# Altium schematic sheet MCU.SchDoc: MCU
size 297 x 209 mm; Author: Dmitry Shpakov; Organization: NoName; Revision: Revision; SheetNumber: 6; SheetTotal: 10; PageSize: A4; ProjectName: Project Name
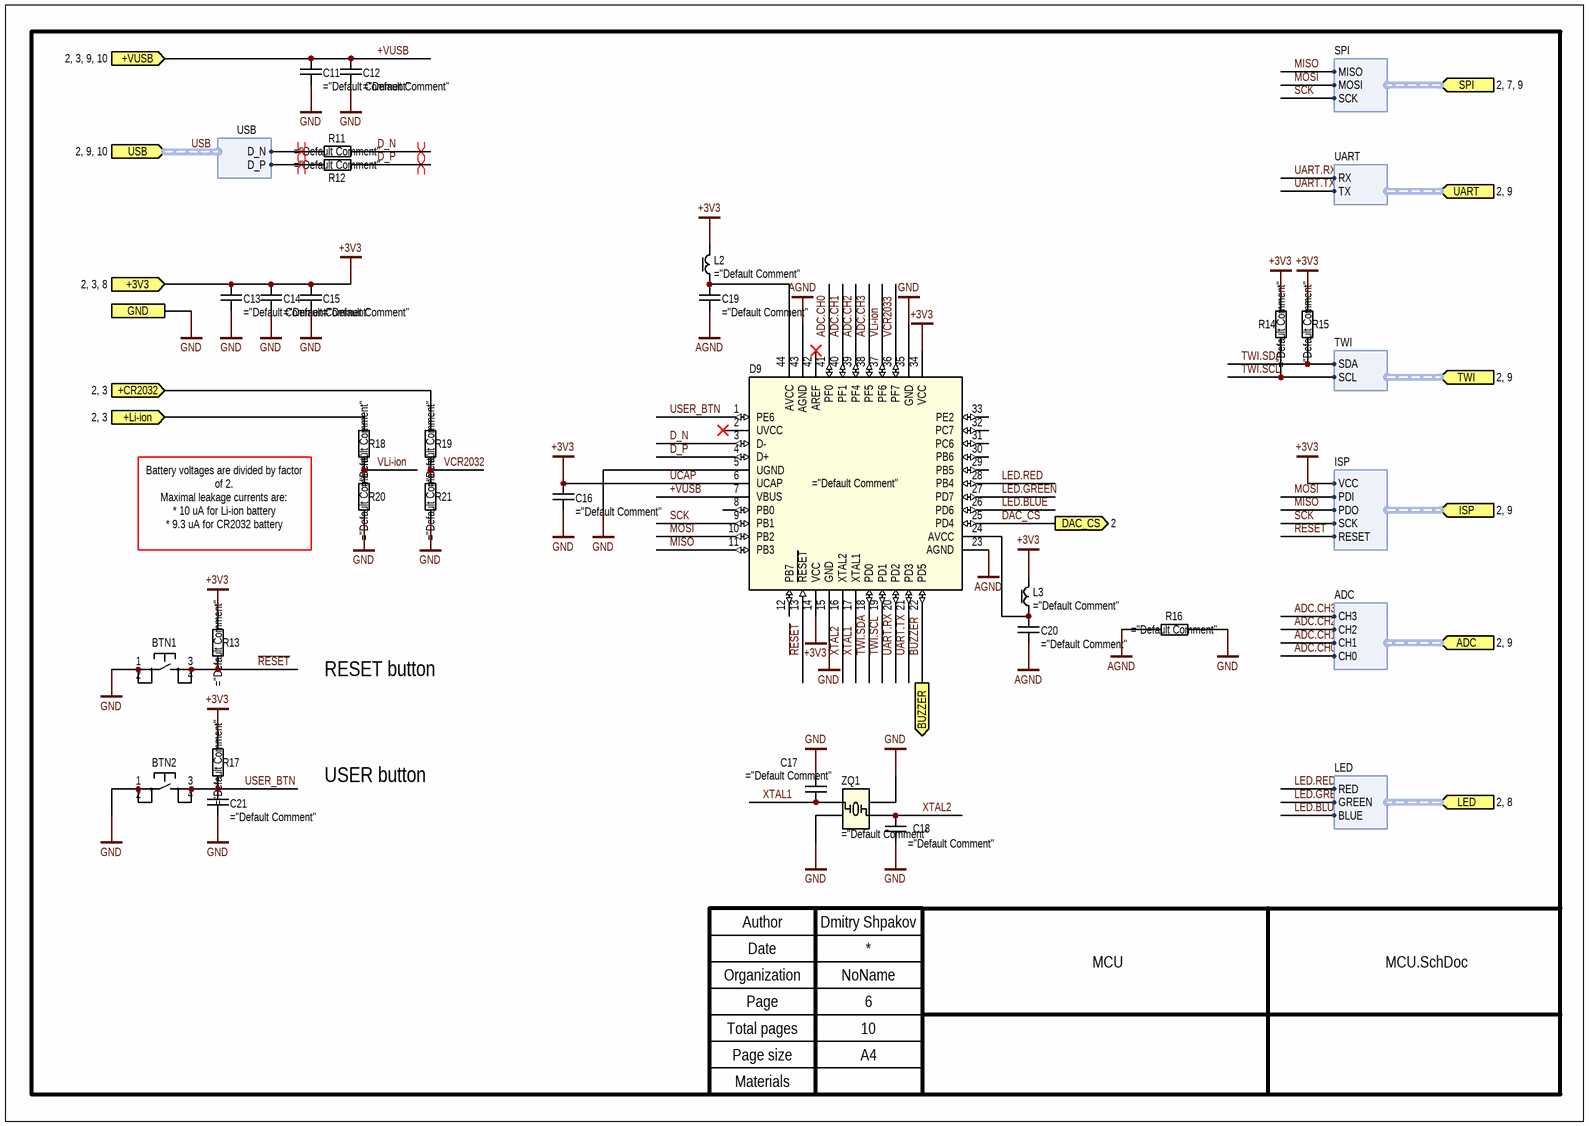
[diagram p0: MCU.SchDoc]

## Parts
BTN1  (no value)
BTN2  (no value)
C11  (no value)
C12  (no value)
C13  (no value)
C14  (no value)
C15  (no value)
C16  (no value)
C17  (no value)
C18  (no value)
C19  (no value)
C20  (no value)
C21  (no value)
D9  (no value)
L2  (no value)
L3  (no value)
R11  (no value)
R12  (no value)
R13  (no value)
R14  (no value)
R15  (no value)
R16  (no value)
R17  (no value)
R18  (no value)
R19  (no value)
R20  (no value)
R21  (no value)
ZQ1  (no value)

## Ports
+3V3 (in, see 2, 3, 8), +CR2032 (in, see 2, 3), +Li-ion (in, see 2, 3), +VUSB (in, see 2, 3, 9, 10), ADC (in, harness ADC, see 2, 9), BUZZER (out), DAC_CS (out, see 2), GND (see 2, 3, 4, 5, 7, 8, 9, 10), ISP (in, harness ISP, see 2, 9), LED (in, harness LED, see 2, 8), SPI (in, harness SPI, see 2, 7, 9), TWI (in, harness TWI, see 2, 9), UART (in, harness UART, see 2, 9), USB (in, harness USB, see 2, 9, 10)

## Harnesses
USB: D_N, D_P
SPI: MISO, MOSI, SCK
UART: RX, TX
TWI: SDA, SCL
ISP: VCC, PDI, PDO, SCK, RESET
ADC: CH3, CH2, CH1, CH0
LED: RED, GREEN, BLUE

## Nets
AGND: C19.1 C20.1 D9.23(AGND) D9.43(AGND) R16.1
GND: BTN1.1 BTN1.2 BTN2.1 BTN2.2 C11.1 C12.1 C13.1 C14.1 C15.1 C16.1 C17.1 C18.1 C21.1 D9.5(UGND) D9.15(GND) D9.35(GND) R16.2 R20.1 R21.1 ZQ1.2 ZQ1.4 ; port GND
UCAP: C13.2 C14.2 C15.2 C16.2 D9.6(UCAP) D9.14(VCC) D9.34(VCC) L2.2 L3.2 R13.2 R14.2 R15.2 R17.2 ; port +3V3, port ISP.VCC  [also labelled +3V3]
+CR2032: R19.2 ; port +CR2032
+Li-ion: R18.2 ; port +Li-ion
+VUSB: C11.2 C12.2 D9.7(VBUS) ; port +VUSB
ADC.CH0: D9.41(PF0) ; port ADC.CH0
ADC.CH1: D9.40(PF1) ; port ADC.CH1
ADC.CH2: D9.39(PF4) ; port ADC.CH2
ADC.CH3: D9.38(PF5) ; port ADC.CH3
BUZZER: D9.22(PD5) ; port BUZZER
D_N: D9.3(D-) R11.2
D_P: D9.4(D+) R12.2
DAC_CS: D9.25(PD4) ; port DAC_CS
LED.BLUE: D9.26(PD6) ; port LED.BLUE
LED.GREEN: D9.27(PD7) ; port LED.GREEN
LED.RED: D9.28(PB4) ; port LED.RED
MISO: D9.11(PB3) ; port SPI.MISO, port ISP.PDO
MOSI: D9.10(PB2) ; port SPI.MOSI, port ISP.PDI
~{RESET}: BTN1.3 BTN1.4 D9.13(~{RESET}) R13.1 ; port ISP.RESET
SCK: D9.9(PB1) ; port SPI.SCK, port ISP.SCK
TWI.SCL: D9.19(PD1) R14.1 ; port TWI.SCL
TWI.SDA: D9.18(PD0) R15.1 ; port TWI.SDA
UART.RX: D9.20(PD2) ; port UART.RX
UART.TX: D9.21(PD3) ; port UART.TX
USB.D_N: R11.1 ; port USB.D_N
USB.D_P: R12.1 ; port USB.D_P
USER_BTN: BTN2.3 BTN2.4 C21.2 D9.1(PE6) R17.1
VCR2032: R19.1 R21.2
VCR2033: D9.36(PF7)
VLi-ion: D9.37(PF6) R18.1 R20.2
XTAL1: C17.2 D9.17(XTAL1) ZQ1.1
XTAL2: C18.2 D9.16(XTAL2) ZQ1.3
NetC19_2: C19.2 D9.44(AVCC) L2.1
NetC20_2: C20.2 D9.24(AVCC) L3.1

Not connected (* = marked no-connect by the designer): D9 2(UVCC)* 8(PB0) 12(PB7) 29(PB5) 30(PB6) 31(PC6) 32(PC7) 33(PE2) 42(AREF)*

## Buses and harness runs
harness USB = port USB

## Layout directives
differential pair: D_N, D_P, USB.D_N, USB.D_P

## Notes on the sheet
- Battery voltages are divided by factor of 2.
  Maximal leakage currents are:
  * 10 uA for Li-ion battery
  * 9.3 uA for CR2032 battery
- RESET button
- USER button
- Author
- Date
- Organization
- Page
- Total pages
- Materials
- Page size

## Library data of the parts
BTN1 BTN2 = PTS810 SJK 250 SMTR LFS: SWITCH TACTILE SPST-NO 0.05A 16V; Manufacturer: C&K; Power Dissipation: * W; Rated Voltage: * V; Rated Current: * A; Tolerance: * %; Other: Tactile Switch SPST-NO Top Actuated Surface Mount; Operating Temperature: -40 °C to +85 °C; Type: button; HelpURL: https://www.digikey.com/en/products/detail/c-k/PTS810-SJK-250-SMTR-LFS/4176611; Default Comment: PTS810 SJK 250 SMTR LFS; Rated Power: * W; Value: *; Summary: ="Type"+" "+"Part Number"+" "+"Manufacturer"+" "+"Value"+" "+"Tolerance"+" "+"Operating Temperature"+" "+"Case"+" "+"Power Dissipation"+" "+"Rated Current"+" "+"Rated Power"+" "+"Rated Voltage"+" "+"Other"; Assembly: *; Case: 4.20mm x 3.20mm; Part Number: PTS810 SJK 250 SMTR LFS
C11 C13 C14 = CC0805KPX5R6BB106: CAP CER 10UF 10V X5R 0805; Manufacturer: YAGEO; Type: capacitor; Power Dissipation: * W; Rated Current: * A; Tolerance: 10 %; Other: 10 µF ±10% 10V Ceramic Capacitor X5R 0805 (2012 Metric); Operating Temperature: -55 °C to +85 °C; HelpURL: https://www.digikey.com/en/products/detail/yageo/CC0805KPX5R6BB106/11611309; Default Comment: 10 uF; Rated Voltage: 10 V; Rated Power: * W; Value: 10 uF; Summary: ="Type"+" "+"Part Number"+" "+"Manufacturer"+" "+"Value"+" "+"Tolerance"+" "+"Operating Temperature"+" "+"Case"+" "+"Power Dissipation"+" "+"Rated Current"+" "+"Rated Power"+" "+"Rated Voltage"+" "+"Other"; Assembly: *; Case: 0805; Part Number: CC0805KPX5R6BB106
C12 C15 C16 = CC0805KKX5R6BB105: CAP CER 1UF 10V X5R 0805; Manufacturer: YAGEO; Type: capacitor; Power Dissipation: * W; Rated Current: * A; Tolerance: 10 %; Other: 1 µF ±10% 10V Ceramic Capacitor X5R 0805 (2012 Metric); Operating Temperature: -55 °C to +85 °C; HelpURL: https://www.digikey.com/en/products/detail/yageo/CC0805KKX5R6BB105/2345239; Default Comment: 1 uF; Rated Voltage: 10 V; Rated Power: * W; Value: 1 uF; Summary: ="Type"+" "+"Part Number"+" "+"Manufacturer"+" "+"Value"+" "+"Tolerance"+" "+"Operating Temperature"+" "+"Case"+" "+"Power Dissipation"+" "+"Rated Current"+" "+"Rated Power"+" "+"Rated Voltage"+" "+"Other"; Assembly: *; Case: 0805; Part Number: CC0805KKX5R6BB105
C17 C18 = CC0603JRNPO9BN120: CAP CER 12PF 50V C0G/NPO 0603; Manufacturer: YAGEO; Type: capacitor; Power Dissipation: * W; Rated Current: * A; Tolerance: 5 %; Other: 12 pF ±5% 50V Ceramic Capacitor C0G, NP0 0603 (1608 Metric); Operating Temperature: -55 °C to +125 °C; HelpURL: https://www.digikey.com/en/products/detail/yageo/CC0603JRNPO9BN120/302793; Default Comment: 12 pF; Rated Power: * W; Value: 12 pF; Summary: ="Type"+" "+"Part Number"+" "+"Manufacturer"+" "+"Value"+" "+"Tolerance"+" "+"Operating Temperature"+" "+"Case"+" "+"Power Dissipation"+" "+"Rated Current"+" "+"Rated Power"+" "+"Rated Voltage"+" "+"Other"; Assembly: *; Case: 0603; Part Number: CC0603JRNPO9BN120; Rated Voltage: 50 V
C19-C21 = CC0805KRX7R9BB104: CAP CER 0.1UF 50V X7R 0805; Manufacturer: YAGEO; Type: capacitor; Power Dissipation: * W; Rated Current: * A; Tolerance: 10 %; Other: 0.1 µF ±10% 50V Ceramic Capacitor X7R 0805 (2012 Metric); Operating Temperature: -55 °C to +125 °C; HelpURL: https://www.digikey.com/en/products/detail/yageo/CC0805KRX7R9BB104/302874; Default Comment: 0.1 uF; Rated Voltage: 50 V; Rated Power: * W; Value: 0.1 uF; Summary: ="Type"+" "+"Part Number"+" "+"Manufacturer"+" "+"Value"+" "+"Tolerance"+" "+"Operating Temperature"+" "+"Case"+" "+"Power Dissipation"+" "+"Rated Current"+" "+"Rated Power"+" "+"Rated Voltage"+" "+"Other"; Assembly: *; Case: 0805; Part Number: CC0805KRX7R9BB104
D9 = ATMEGA32U4-MU: IC MCU 8BIT 32KB FLASH 44VQFN; Manufacturer: Microchip Technology; Power Dissipation: * W; Rated Voltage: 2.7V ~ 5.5 V; Rated Current: * A; Tolerance: * %; Other: AVR AVR® ATmega Microcontroller IC 8-Bit 16MHz 32KB (16K x 16) FLASH 44-VQFN (7x7); Operating Temperature: -40 °C to +85 °C; Type: ic; HelpURL: https://www.digikey.com/en/products/detail/microchip-technology/ATMEGA32U4-MU/1914603; Default Comment: ATMEGA32U4-MU; Rated Power: * W; Value: *; Summary: ="Type"+" "+"Part Number"+" "+"Manufacturer"+" "+"Value"+" "+"Tolerance"+" "+"Operating Temperature"+" "+"Case"+" "+"Power Dissipation"+" "+"Rated Current"+" "+"Rated Power"+" "+"Rated Voltage"+" "+"Other"; Assembly: *; Case: 44-VQFN (7x7); Part Number: ATMEGA32U4-MU
L2 L3 = 74479887310A: FIXED IND 10UH 850MA 300MOHM SMD; Manufacturer: Würth Elektronik; Type: inductor; Power Dissipation: * W; Rated Voltage: * V; Tolerance: * %; Other: 10 µH Shielded Multilayer Inductor 850 mA 300mOhm 1008 (2520 Metric); Operating Temperature: -40 °C to +125 °C; HelpURL: https://www.digikey.com/en/products/detail/w%C3%BCrth-elektronik/74479887310A/4120129; Default Comment: 10 uH; Rated Current: 850 mA; Rated Power: * W; Value: 10 uH; Summary: ="Type"+" "+"Part Number"+" "+"Manufacturer"+" "+"Value"+" "+"Tolerance"+" "+"Operating Temperature"+" "+"Case"+" "+"Power Dissipation"+" "+"Rated Current"+" "+"Rated Power"+" "+"Rated Voltage"+" "+"Other"; Assembly: *; Case: 1008; Part Number: 74479887310A
R11 R12 = RC0603FR-0722RL: RES 22 OHM 1% 1/10W 0603; Manufacturer: YAGEO; Default Comment: 22R; Rated Voltage: * V; Rated Current: * A; Value: 22R; Other: 22 Ohms ±1% 0.1W, 1/10W Chip Resistor 0603 (1608 Metric) Moisture Resistant Thick Film; Operating Temperature: -55 °C to +155 °C; Type: resistor; HelpURL: https://www.digikey.com/en/products/detail/yageo/RC0603FR-0722RL/727055; Power Dissipation: 1/10 W; Rated Power: 1/10 W; Tolerance: 1 %; Summary: ="Type"+" "+"Part Number"+" "+"Manufacturer"+" "+"Value"+" "+"Tolerance"+" "+"Operating Temperature"+" "+"Case"+" "+"Power Dissipation"+" "+"Rated Current"+" "+"Rated Power"+" "+"Rated Voltage"+" "+"Other"; Assembly: *; Case: 0603; Part Number: RC0603FR-0722RL
R13 R17 = RC0603FR-0762KL: RES 62K OHM 1% 1/10W 0603; Manufacturer: YAGEO; Power Dissipation: 0.1 W; Rated Voltage: * V; Rated Current: * A; Other: 62 kOhms ±1% 0.1W, 1/10W Chip Resistor 0603 (1608 Metric) Moisture Resistant Thick Film; Operating Temperature: -55 °C to +155 °C; Type: resistor; HelpURL: https://www.digikey.com/en/products/detail/yageo/RC0603FR-0762KL/727336; Default Comment: 62k; Rated Power: 0.1 W; Tolerance: 1 %; Value: 62k; Summary: ="Type"+" "+"Part Number"+" "+"Manufacturer"+" "+"Value"+" "+"Tolerance"+" "+"Operating Temperature"+" "+"Case"+" "+"Power Dissipation"+" "+"Rated Current"+" "+"Rated Power"+" "+"Rated Voltage"+" "+"Other"; Assembly: *; Case: 0603; Part Number: RC0603FR-0762KL
R14 R15 = RC0603FR-075K1L: RES 5.1K OHM 1% 1/10W 0603; Manufacturer: YAGEO; Default Comment: 5k1; Rated Voltage: * V; Rated Current: * A; Value: 5k1; Other: 5.1 kOhms ±1% 0.1W, 1/10W Chip Resistor 0603 (1608 Metric) Moisture Resistant Thick Film; Operating Temperature: -55 °C to +155 °C; Type: resistor; HelpURL: https://www.digikey.com/en/products/detail/yageo/RC0603FR-075K1L/727268; Power Dissipation: 1/10 W; Rated Power: 1/10 W; Tolerance: 1 %; Summary: ="Type"+" "+"Part Number"+" "+"Manufacturer"+" "+"Value"+" "+"Tolerance"+" "+"Operating Temperature"+" "+"Case"+" "+"Power Dissipation"+" "+"Rated Current"+" "+"Rated Power"+" "+"Rated Voltage"+" "+"Other"; Assembly: *; Case: 0603; Part Number: RC0603FR-075K1L
R16 = RC0603JR-070RL: RES 0 OHM JUMPER 1/10W 0603; Manufacturer: YAGEO; Default Comment: 0R; Power Dissipation: * W; Rated Voltage: * V; Rated Current: * A; Tolerance: * %; Value: 0R; Other: 0 Ohms Jumper Chip Resistor 0603 (1608 Metric) Moisture Resistant Thick Film; Operating Temperature: -55 °C to +155 °C; Type: resistor; HelpURL: https://www.digikey.com/en/products/detail/yageo/RC0603JR-070RL/726675; Rated Power: * W; Summary: ="Type"+" "+"Part Number"+" "+"Manufacturer"+" "+"Value"+" "+"Tolerance"+" "+"Operating Temperature"+" "+"Case"+" "+"Power Dissipation"+" "+"Rated Current"+" "+"Rated Power"+" "+"Rated Voltage"+" "+"Other"; Assembly: *; Case: 0603; Part Number: RC0603JR-070RL
R18-R21 = RC0603FR-07200KL: RES 200K OHM 1% 1/10W 0603; Manufacturer: YAGEO; Power Dissipation: 0.1 W; Rated Voltage: * V; Rated Current: * A; Other: 200 kOhms ±1% 0.1W, 1/10W Chip Resistor 0603 (1608 Metric) Moisture Resistant Thick Film; Operating Temperature: -55 °C to +155 °C; Type: resistor; HelpURL: https://www.digikey.com/en/products/detail/yageo/RC0603FR-07200KL/727044; Default Comment: 200k; Rated Power: 0.1 W; Tolerance: 1 %; Value: 200k; Summary: ="Type"+" "+"Part Number"+" "+"Manufacturer"+" "+"Value"+" "+"Tolerance"+" "+"Operating Temperature"+" "+"Case"+" "+"Power Dissipation"+" "+"Rated Current"+" "+"Rated Power"+" "+"Rated Voltage"+" "+"Other"; Assembly: *; Case: 0603; Part Number: RC0603FR-07200KL
ZQ1 = ECS-80-12-33-JGN-TR: CRYSTAL 8.0000MHZ 12PF SMD; Manufacturer: ECS Inc.; Power Dissipation: * W; Rated Voltage: * V; Rated Current: * A; Tolerance: 20 ppm; Other: 8 MHz ±20ppm Crystal 12pF 400 Ohms 4-SMD, No Lead; Operating Temperature: -40 °C to +85 °C; Type: crystall; HelpURL: https://www.digikey.com/en/products/detail/ecs-inc/ECS-80-12-33-JGN-TR/10478754; Default Comment: 8.0000 MHz; Rated Power: * W; Value: 8.0000 MHz; Summary: ="Type"+" "+"Part Number"+" "+"Manufacturer"+" "+"Value"+" "+"Tolerance"+" "+"Operating Temperature"+" "+"Case"+" "+"Power Dissipation"+" "+"Rated Current"+" "+"Rated Power"+" "+"Rated Voltage"+" "+"Other"; Assembly: *; Case: 3.20mm x 2.50mm; Part Number: ECS-80-12-33-JGN-TR